# EAGLE design con68k-led (EAGLE 7.6.0)
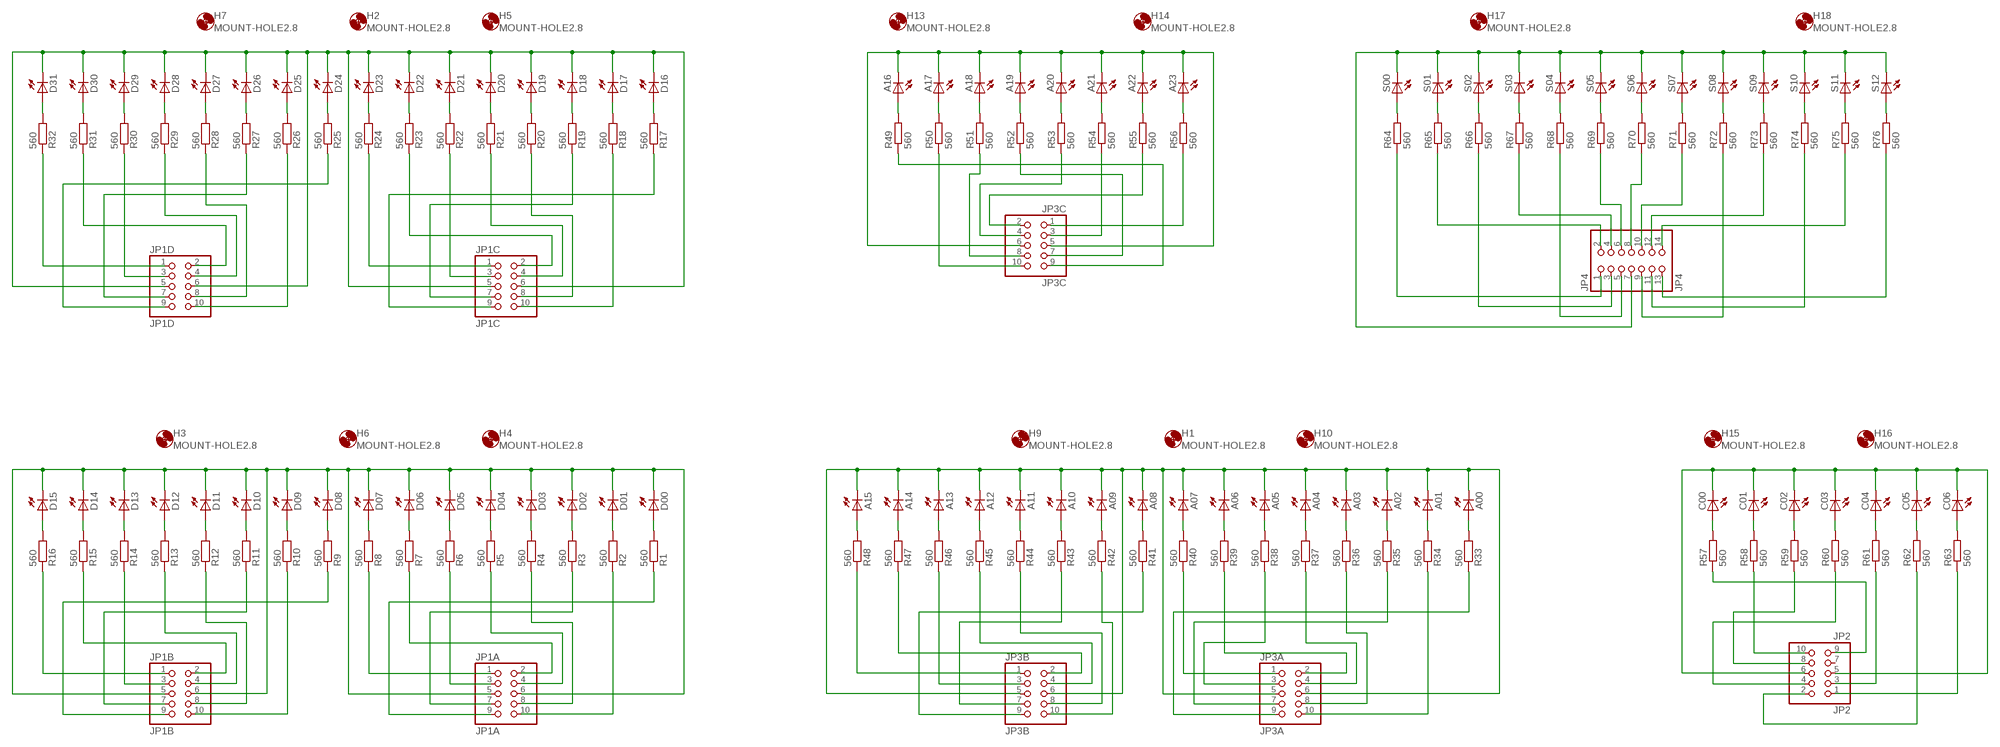
[diagram p0: schematic, sheet 1]

## Parts
A00  LED5MM  [LED5MM]
A01  LED5MM  [LED5MM]
A02  LED5MM  [LED5MM]
A03  LED5MM  [LED5MM]
A04  LED5MM  [LED5MM]
A05  LED5MM  [LED5MM]
A06  LED5MM  [LED5MM]
A07  LED5MM  [LED5MM]
A08  LED5MM  [LED5MM]
A09  LED5MM  [LED5MM]
A10  LED5MM  [LED5MM]
A11  LED5MM  [LED5MM]
A12  LED5MM  [LED5MM]
A13  LED5MM  [LED5MM]
A14  LED5MM  [LED5MM]
A15  LED5MM  [LED5MM]
A16  LED5MM  [LED5MM]
A17  LED5MM  [LED5MM]
A18  LED5MM  [LED5MM]
A19  LED5MM  [LED5MM]
A20  LED5MM  [LED5MM]
A21  LED5MM  [LED5MM]
A22  LED5MM  [LED5MM]
A23  LED5MM  [LED5MM]
C00  LED5MM  [LED5MM]
C01  LED5MM  [LED5MM]
C02  LED5MM  [LED5MM]
C03  LED5MM  [LED5MM]
C04  LED5MM  [LED5MM]
C05  LED5MM  [LED5MM]
C06  LED5MM  [LED5MM]
D00  LED5MM  [LED5MM]
D01  LED5MM  [LED5MM]
D02  LED5MM  [LED5MM]
D03  LED5MM  [LED5MM]
D04  LED5MM  [LED5MM]
D05  LED5MM  [LED5MM]
D06  LED5MM  [LED5MM]
D07  LED5MM  [LED5MM]
D08  LED5MM  [LED5MM]
D09  LED5MM  [LED5MM]
D10  LED5MM  [LED5MM]
D11  LED5MM  [LED5MM]
D12  LED5MM  [LED5MM]
D13  LED5MM  [LED5MM]
D14  LED5MM  [LED5MM]
D15  LED5MM  [LED5MM]
D16  LED5MM  [LED5MM]
D17  LED5MM  [LED5MM]
D18  LED5MM  [LED5MM]
D19  LED5MM  [LED5MM]
D20  LED5MM  [LED5MM]
D21  LED5MM  [LED5MM]
D22  LED5MM  [LED5MM]
D23  LED5MM  [LED5MM]
D24  LED5MM  [LED5MM]
D25  LED5MM  [LED5MM]
D26  LED5MM  [LED5MM]
D27  LED5MM  [LED5MM]
D28  LED5MM  [LED5MM]
D29  LED5MM  [LED5MM]
D30  LED5MM  [LED5MM]
D31  LED5MM  [LED5MM]
H1  MOUNT-HOLE2.8  [2,8]
H2  MOUNT-HOLE2.8  [2,8]
H3  MOUNT-HOLE2.8  [2,8]
H4  MOUNT-HOLE2.8  [2,8]
H5  MOUNT-HOLE2.8  [2,8]
H6  MOUNT-HOLE2.8  [2,8]
H7  MOUNT-HOLE2.8  [2,8]
H9  MOUNT-HOLE2.8  [2,8]
H10  MOUNT-HOLE2.8  [2,8]
H13  MOUNT-HOLE2.8  [2,8]
H14  MOUNT-HOLE2.8  [2,8]
H15  MOUNT-HOLE2.8  [2,8]
H16  MOUNT-HOLE2.8  [2,8]
H17  MOUNT-HOLE2.8  [2,8]
H18  MOUNT-HOLE2.8  [2,8]
JP1A  JP1A  PINHD-2X5  [2X05]
JP1B  JP1B  PINHD-2X5  [2X05]
JP1C  JP1C  PINHD-2X5  [2X05]
JP1D  JP1D  PINHD-2X5  [2X05]
JP2  JP2  PINHD-2X5  [2X05]
JP3A  JP3A  PINHD-2X5  [2X05]
JP3B  JP3B  PINHD-2X5  [2X05]
JP3C  JP3C  PINHD-2X5  [2X05]
JP4  JP4  PINHD-2X7  [2X07]
R1  560  R-EU_0204/7  [0204/7]
R2  560  R-EU_0204/7  [0204/7]
R3  560  R-EU_0204/7  [0204/7]
R4  560  R-EU_0204/7  [0204/7]
R5  560  R-EU_0204/7  [0204/7]
R6  560  R-EU_0204/7  [0204/7]
R7  560  R-EU_0204/7  [0204/7]
R8  560  R-EU_0204/7  [0204/7]
R9  560  R-EU_0204/7  [0204/7]
R10  560  R-EU_0204/7  [0204/7]
R11  560  R-EU_0204/7  [0204/7]
R12  560  R-EU_0204/7  [0204/7]
R13  560  R-EU_0204/7  [0204/7]
R14  560  R-EU_0204/7  [0204/7]
R15  560  R-EU_0204/7  [0204/7]
R16  560  R-EU_0204/7  [0204/7]
R17  560  R-EU_0204/7  [0204/7]
R18  560  R-EU_0204/7  [0204/7]
R19  560  R-EU_0204/7  [0204/7]
R20  560  R-EU_0204/7  [0204/7]
R21  560  R-EU_0204/7  [0204/7]
R22  560  R-EU_0204/7  [0204/7]
R23  560  R-EU_0204/7  [0204/7]
R24  560  R-EU_0204/7  [0204/7]
R25  560  R-EU_0204/7  [0204/7]
R26  560  R-EU_0204/7  [0204/7]
R27  560  R-EU_0204/7  [0204/7]
R28  560  R-EU_0204/7  [0204/7]
R29  560  R-EU_0204/7  [0204/7]
R30  560  R-EU_0204/7  [0204/7]
R31  560  R-EU_0204/7  [0204/7]
R32  560  R-EU_0204/7  [0204/7]
R33  560  R-EU_0204/7  [0204/7]
R34  560  R-EU_0204/7  [0204/7]
R35  560  R-EU_0204/7  [0204/7]
R36  560  R-EU_0204/7  [0204/7]
R37  560  R-EU_0204/7  [0204/7]
R38  560  R-EU_0204/7  [0204/7]
R39  560  R-EU_0204/7  [0204/7]
R40  560  R-EU_0204/7  [0204/7]
R41  560  R-EU_0204/7  [0204/7]
R42  560  R-EU_0204/7  [0204/7]
R43  560  R-EU_0204/7  [0204/7]
R44  560  R-EU_0204/7  [0204/7]
R45  560  R-EU_0204/7  [0204/7]
R46  560  R-EU_0204/7  [0204/7]
R47  560  R-EU_0204/7  [0204/7]
R48  560  R-EU_0204/7  [0204/7]
R49  560  R-EU_0204/7  [0204/7]
R50  560  R-EU_0204/7  [0204/7]
R51  560  R-EU_0204/7  [0204/7]
R52  560  R-EU_0204/7  [0204/7]
R53  560  R-EU_0204/7  [0204/7]
R54  560  R-EU_0204/7  [0204/7]
R55  560  R-EU_0204/7  [0204/7]
R56  560  R-EU_0204/7  [0204/7]
R57  560  R-EU_0204/7  [0204/7]
R58  560  R-EU_0204/7  [0204/7]
R59  560  R-EU_0204/7  [0204/7]
R60  560  R-EU_0204/7  [0204/7]
R61  560  R-EU_0204/7  [0204/7]
R62  560  R-EU_0204/7  [0204/7]
R63  560  R-EU_0204/7  [0204/7]
R64  560  R-EU_0204/7  [0204/7]
R65  560  R-EU_0204/7  [0204/7]
R66  560  R-EU_0204/7  [0204/7]
R67  560  R-EU_0204/7  [0204/7]
R68  560  R-EU_0204/7  [0204/7]
R69  560  R-EU_0204/7  [0204/7]
R70  560  R-EU_0204/7  [0204/7]
R71  560  R-EU_0204/7  [0204/7]
R72  560  R-EU_0204/7  [0204/7]
R73  560  R-EU_0204/7  [0204/7]
R74  560  R-EU_0204/7  [0204/7]
R75  560  R-EU_0204/7  [0204/7]
R76  560  R-EU_0204/7  [0204/7]
S00  LED5MM  [LED5MM]
S01  LED5MM  [LED5MM]
S02  LED5MM  [LED5MM]
S03  LED5MM  [LED5MM]
S04  LED5MM  [LED5MM]
S05  LED5MM  [LED5MM]
S06  LED5MM  [LED5MM]
S07  LED5MM  [LED5MM]
S08  LED5MM  [LED5MM]
S09  LED5MM  [LED5MM]
S10  LED5MM  [LED5MM]
S11  LED5MM  [LED5MM]
S12  LED5MM  [LED5MM]

## Nets
N$1: D00.K(C) D01.K(C) D02.K(C) D03.K(C) D04.K(C) D05.K(C) D06.K(C) D07.K(C) D08.K(C) D09.K(C) D10.K(C) D11.K(C) D12.K(C) D13.K(C) D14.K(C) D15.K(C) JP1A.5 JP1A.6 JP1B.5 JP1B.6
N$2: D15.A R16.2
N$3: D14.A R15.2
N$4: D13.A R14.2
N$5: D12.A R13.2
N$6: D11.A R12.2
N$7: D10.A R11.2
N$8: D09.A R10.2
N$9: D08.A R9.2
N$10: D07.A R8.2
N$11: D06.A R7.2
N$12: D05.A R6.2
N$13: D04.A R5.2
N$14: D03.A R4.2
N$15: D02.A R3.2
N$16: D01.A R2.2
N$17: D00.A R1.2
N$18: JP1B.1 R16.1
N$19: JP1B.2 R15.1
N$20: JP1B.3 R14.1
N$21: JP1B.4 R13.1
N$22: JP1B.8 R12.1
N$23: JP1B.7 R11.1
N$24: JP1B.10 R10.1
N$25: JP1B.9 R9.1
N$26: JP1A.1 R8.1
N$27: JP1A.2 R7.1
N$28: JP1A.3 R6.1
N$29: JP1A.4 R5.1
N$30: JP1A.8 R4.1
N$31: JP1A.7 R3.1
N$32: JP1A.10 R2.1
N$33: JP1A.9 R1.1
N$34: D16.K(C) D17.K(C) D18.K(C) D19.K(C) D20.K(C) D21.K(C) D22.K(C) D23.K(C) D24.K(C) D25.K(C) D26.K(C) D27.K(C) D28.K(C) D29.K(C) D30.K(C) D31.K(C) JP1C.5 JP1C.6 JP1D.5 JP1D.6
N$35: D31.A R32.2
N$36: D30.A R31.2
N$37: D29.A R30.2
N$38: D28.A R29.2
N$39: D27.A R28.2
N$40: D26.A R27.2
N$41: D25.A R26.2
N$42: D24.A R25.2
N$43: D23.A R24.2
N$44: D22.A R23.2
N$45: D21.A R22.2
N$46: D20.A R21.2
N$47: D19.A R20.2
N$48: D18.A R19.2
N$49: D17.A R18.2
N$50: D16.A R17.2
N$51: A15.A R48.2
N$52: JP1D.1 R32.1
N$53: JP1D.2 R31.1
N$54: JP1D.3 R30.1
N$55: JP1D.4 R29.1
N$56: JP1D.8 R28.1
N$57: JP1D.7 R27.1
N$58: JP1D.10 R26.1
N$59: JP3B.1 R48.1
N$60: JP1D.9 R25.1
N$61: JP1C.1 R24.1
N$62: JP1C.2 R23.1
N$63: JP1C.3 R22.1
N$64: JP1C.4 R21.1
N$65: A14.A R47.2
N$66: JP1C.8 R20.1
N$67: A00.K(C) A01.K(C) A02.K(C) A03.K(C) A04.K(C) A05.K(C) A06.K(C) A07.K(C) A08.K(C) A09.K(C) A10.K(C) A11.K(C) A12.K(C) A13.K(C) A14.K(C) A15.K(C) JP3A.5 JP3A.6 JP3B.5 JP3B.6
N$68: A13.A R46.2
N$69: A12.A R45.2
N$70: A11.A R44.2
N$71: A10.A R43.2
N$72: A09.A R42.2
N$73: A08.A R41.2
N$74: A07.A R40.2
N$75: A06.A R39.2
N$76: A05.A R38.2
N$77: A04.A R37.2
N$78: A03.A R36.2
N$79: A02.A R35.2
N$80: A01.A R34.2
N$81: A00.A R33.2
N$82: A16.A R49.2
N$83: A17.A R50.2
N$84: JP3B.2 R47.1
N$85: JP3B.3 R46.1
N$86: JP3B.4 R45.1
N$87: JP3A.1 R40.1
N$88: JP3B.8 R44.1
N$89: JP3B.7 R43.1
N$90: JP4.1 R64.1
N$91: JP3B.10 R42.1
N$92: JP4.2 R65.1
N$93: JP3B.9 R41.1
N$94: JP3A.2 R39.1
N$95: JP3A.3 R38.1
N$96: JP3A.4 R37.1
N$97: JP3A.8 R36.1
N$98: JP3A.7 R35.1
N$99: JP3A.10 R34.1
N$100: A16.K(C) A17.K(C) A18.K(C) A19.K(C) A20.K(C) A21.K(C) A22.K(C) A23.K(C) JP3C.5 JP3C.6
N$101: A18.A R51.2
N$102: A19.A R52.2
N$103: A20.A R53.2
N$104: A21.A R54.2
N$105: A22.A R55.2
N$106: A23.A R56.2
N$107: R64.2 S00.A
N$108: R65.2 S01.A
N$109: JP2.1 R63.1
N$110: JP3C.1 R56.1
N$111: JP3C.2 R55.1
N$112: JP3C.3 R54.1
N$113: JP3C.4 R53.1
N$114: JP3C.7 R52.1
N$115: JP3C.8 R51.1
N$116: JP3C.10 R50.1
N$117: JP3C.9 R49.1
N$118: C00.K(C) C01.K(C) C02.K(C) C03.K(C) C04.K(C) C05.K(C) C06.K(C) JP2.5 JP2.6
N$119: C00.A R57.2
N$120: C01.A R58.2
N$121: C02.A R59.2
N$122: C03.A R60.2
N$123: C04.A R61.2
N$124: C05.A R62.2
N$125: C06.A R63.2
N$126: JP2.2 R62.1
N$127: JP2.3 R61.1
N$128: JP2.4 R60.1
N$129: JP2.9 R57.1
N$130: JP2.10 R58.1
N$131: JP2.8 R59.1
N$132: JP4.7 S00.K(C) S01.K(C) S02.K(C) S03.K(C) S04.K(C) S05.K(C) S06.K(C) S07.K(C) S08.K(C) S09.K(C) S10.K(C) S11.K(C) S12.K(C)
N$133: R66.2 S02.A
N$134: R67.2 S03.A
N$135: R68.2 S04.A
N$136: R69.2 S05.A
N$137: R70.2 S06.A
N$138: R71.2 S07.A
N$139: R72.2 S08.A
N$140: R73.2 S09.A
N$141: R74.2 S10.A
N$142: R75.2 S11.A
N$143: R76.2 S12.A
N$146: JP4.3 R66.1
N$147: JP4.4 R67.1
N$148: JP4.5 R68.1
N$149: JP4.6 R69.1
N$150: JP4.13 R76.1
N$151: JP4.14 R75.1
N$152: JP4.11 R74.1
N$153: JP4.12 R73.1
N$154: JP4.9 R72.1
N$155: JP4.10 R71.1
N$156: JP4.8 R70.1
N$157: JP3A.9 R33.1
N$158: JP1C.7 R19.1
N$159: JP1C.10 R18.1
N$160: JP1C.9 R17.1
Unconnected: JP2.7

## Library data of the parts
A00 A01-A09 A10-A23 C00 C01-C06 D00 D01-D09 D10-D31 S00 S01-S09 S10-S12 = henk:LED: LEDs Standard schematic elements and footprints for 5mm, 3mm, 1206, and 0603 sized LEDs. 5mm - Spark Fun Electronics SKU : COM-00529 (and others)
H1-H7 H9 H10 H13-H18 = holes:MOUNT-HOLE: MOUNTING HOLE with drill center marker
JP1A JP1B JP1C JP1D JP2 JP3A JP3B JP3C = pinhead:PINHD-2X5: PIN HEADER
JP4 = pinhead:PINHD-2X7: PIN HEADER
R1-R76 = rcl:R-EU_: RESISTOR, European symbol

## Net classes
0 default: width 0.254 mm, drill 0.254 mm, clearance 0.254 mm

## Board
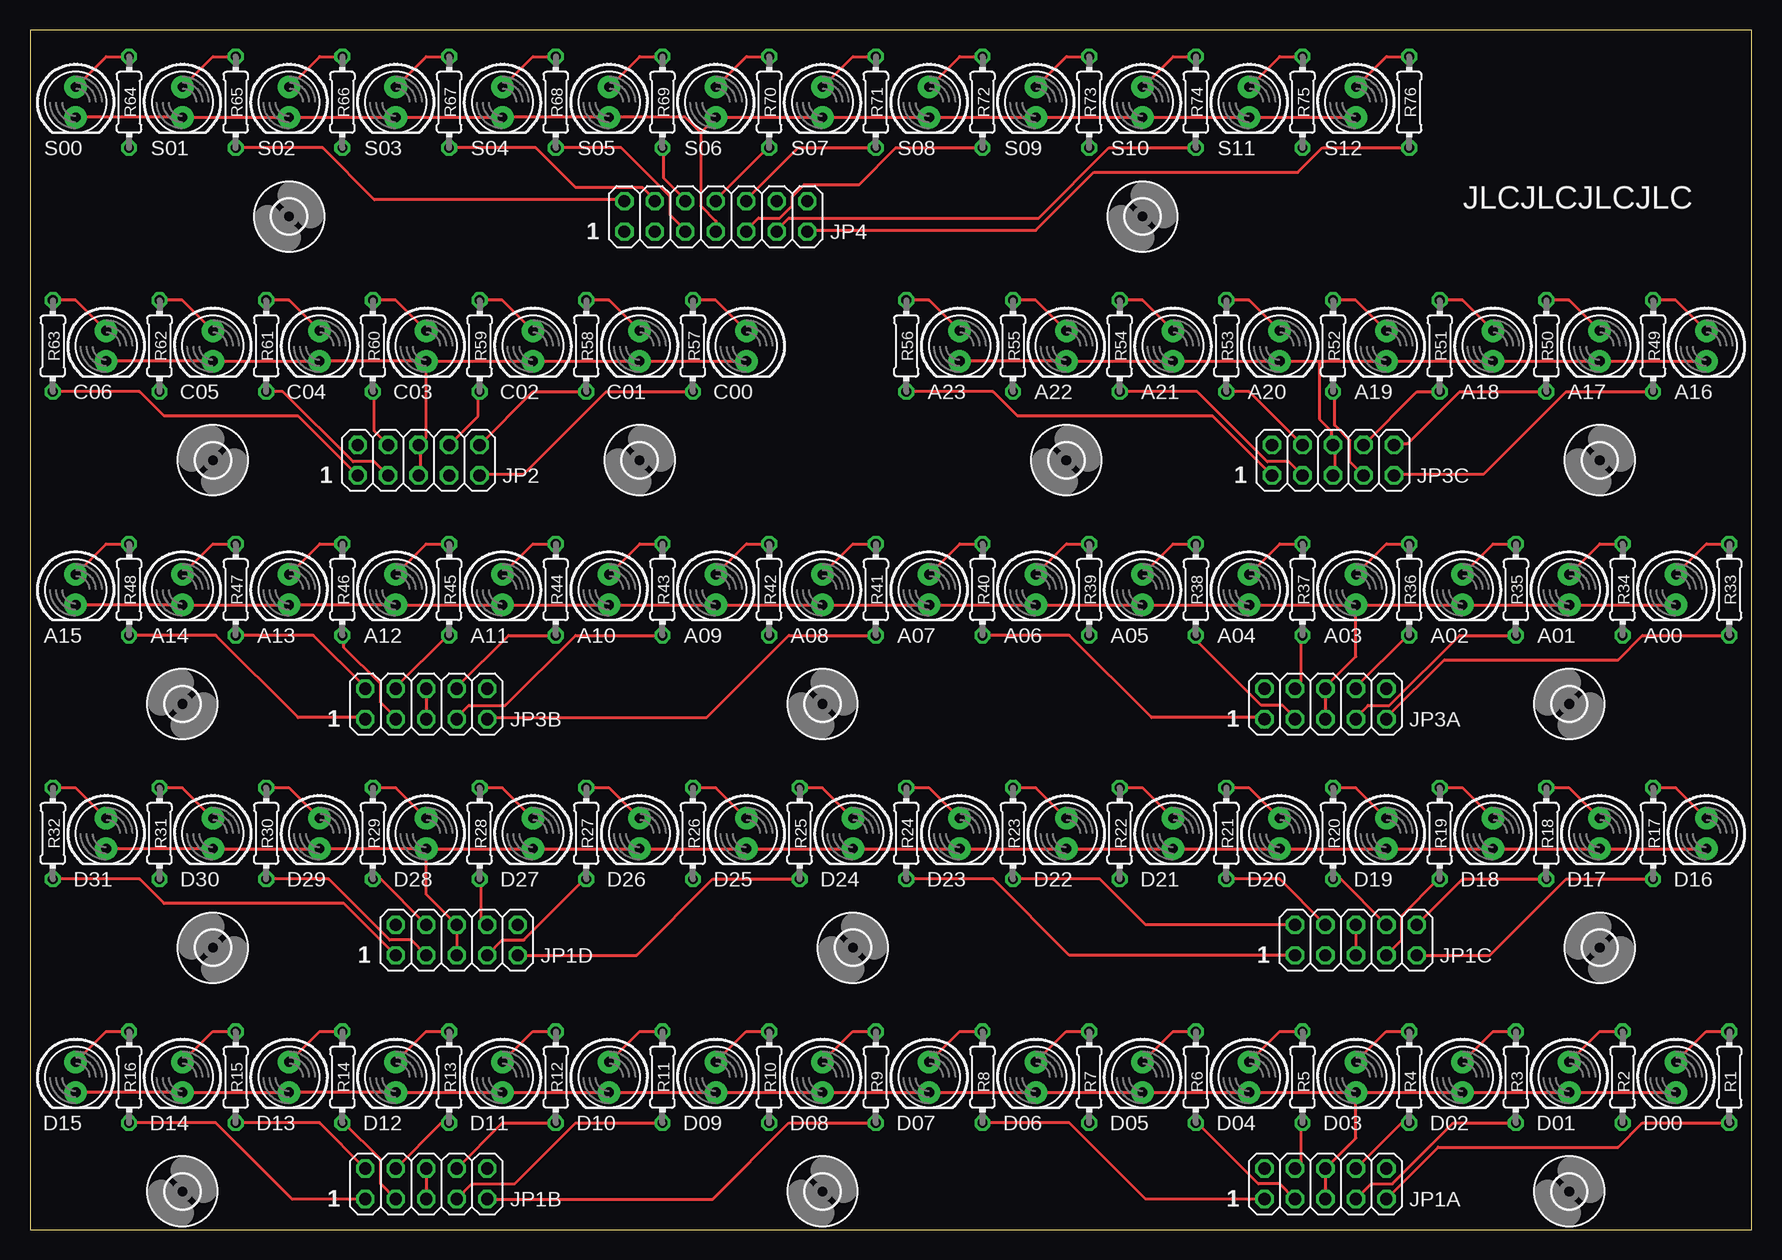
[diagram p1: board, top side]
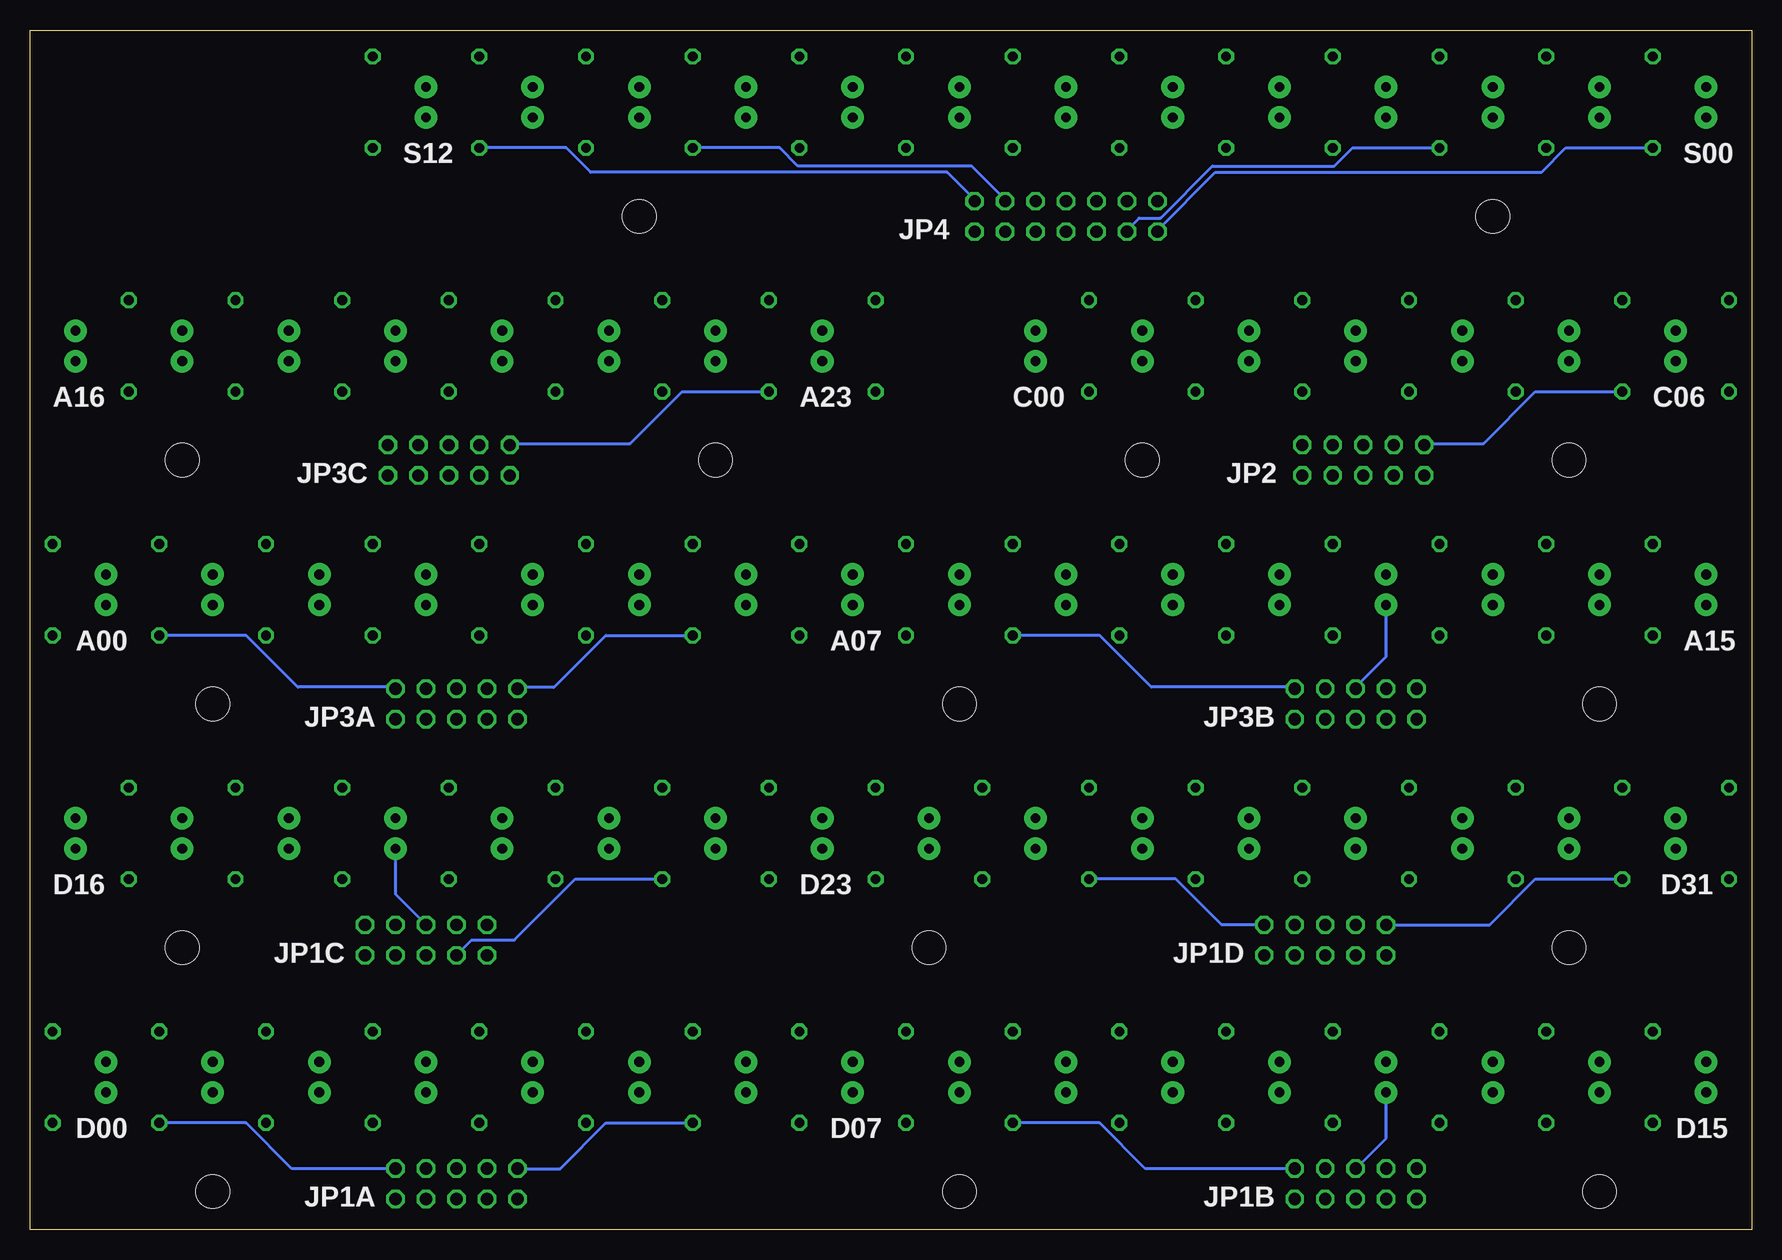
[diagram p2: board, bottom side, seen from below]

Size 143.49 x 100 mm. Coordinates in mm from the lower left corner, seen from the top.
Outline: 0,0 143.49,0 143.49,100 0,100 0,0
Copper layers (1*16): Top 0.035mm / dielectric 1.5mm / Bottom 0.035mm
Design rules "ITEADstudio_DRC": minimum track width 6mil, minimum drill 12mil, track to track 6mil, track to pad 6mil, pad to pad 6mil, via to via 6mil, smd to smd 0mil, copper to edge 10mil, drill to drill 10mil, minimum pad ring 10mil, minimum via ring 6mil, stop-mask expansion 2mil, vias tented up to drill 100mil, thermal gap 10mil

### Footprints (pad centres in the part's own frame; a part is rotated, then mirrored left to right if it is on the bottom)
LED5MM = drill 0.813 pad 1.88: A -1.27,0; K 1.27,0
2,8 = hole 2.8: 0,0
2X05 = drill 1.016 octagon: 1 -5.08,-1.27; 2 -5.08,1.27; 3 -2.54,-1.27; 4 -2.54,1.27; 5 0,-1.27; 6 0,1.27; 7 2.54,-1.27; 8 2.54,1.27; 9 5.08,-1.27; 10 5.08,1.27
2X07 = drill 1.016 octagon: 1 -7.62,-1.27; 2 -7.62,1.27; 3 -5.08,-1.27; 4 -5.08,1.27; 5 -2.54,-1.27; 6 -2.54,1.27; 7 0,-1.27; 8 0,1.27; 9 2.54,-1.27; 10 2.54,1.27; 11 5.08,-1.27; 12 5.08,1.27; 13 7.62,-1.27; 14 7.62,1.27
0204/7 = drill 0.813 octagon: 1 -3.81,0; 2 3.81,0

### Placement (x,y rotation side)
A00  137.16,53.34 270 top
A01  128.27,53.34 270 top
A02  119.38,53.34 270 top
A03  110.49,53.34 270 top
A04  101.6,53.34 270 top
A05  92.71,53.34 270 top
A06  83.82,53.34 270 top
A07  74.93,53.34 270 top
A08  66.04,53.34 270 top
A09  57.15,53.34 270 top
A10  48.26,53.34 270 top
A11  39.37,53.34 270 top
A12  30.48,53.34 270 top
A13  21.59,53.34 270 top
A14  12.7,53.34 270 top
A15  3.81,53.34 270 top
A16  139.7,73.66 270 top
A17  130.81,73.66 270 top
A18  121.92,73.66 270 top
A19  113.03,73.66 270 top
A20  104.14,73.66 270 top
A21  95.25,73.66 270 top
A22  86.36,73.66 270 top
A23  77.47,73.66 270 top
C00  59.69,73.66 270 top
C01  50.8,73.66 270 top
C02  41.91,73.66 270 top
C03  33.02,73.66 270 top
C04  24.13,73.66 270 top
C05  15.24,73.66 270 top
C06  6.35,73.66 270 top
D00  137.16,12.7 270 top
D01  128.27,12.7 270 top
D02  119.38,12.7 270 top
D03  110.49,12.7 270 top
D04  101.6,12.7 270 top
D05  92.71,12.7 270 top
D06  83.82,12.7 270 top
D07  74.93,12.7 270 top
D08  66.04,12.7 270 top
D09  57.15,12.7 270 top
D10  48.26,12.7 270 top
D11  39.37,12.7 270 top
D12  30.48,12.7 270 top
D13  21.59,12.7 270 top
D14  12.7,12.7 270 top
D15  3.81,12.7 270 top
D16  139.7,33.02 270 top
D17  130.81,33.02 270 top
D18  121.92,33.02 270 top
D19  113.03,33.02 270 top
D20  104.14,33.02 270 top
D21  95.25,33.02 270 top
D22  86.36,33.02 270 top
D23  77.47,33.02 270 top
D24  68.58,33.02 270 top
D25  59.69,33.02 270 top
D26  50.8,33.02 270 top
D27  41.91,33.02 270 top
D28  33.02,33.02 270 top
D29  24.13,33.02 270 top
D30  15.24,33.02 270 top
D31  6.35,33.02 270 top
H1  66.04,43.81 0 top
H2  68.58,23.5 0 top
H3  12.7,3.17 0 top
H4  128.27,3.17 0 top
H5  15.24,23.5 90 top
H6  66.04,3.17 0 top
H7  130.81,23.5 90 top
H9  12.7,43.81 90 top
H10  128.27,43.81 90 top
H13  130.81,64.14 0 top
H14  86.36,64.14 0 top
H15  15.24,64.14 90 top
H16  50.8,64.14 0 top
H17  21.59,84.45 0 top
H18  92.71,84.45 0 top
JP1A  107.95,3.81 0 top
JP1B  33.02,3.81 0 top
JP1C  110.49,24.13 0 top
JP1D  35.56,24.13 0 top
JP2  32.38,64.14 0 top
JP3A  107.95,43.81 0 top
JP3B  33.02,43.81 0 top
JP3C  108.58,64.14 0 top
JP4  57.15,84.45 0 top
R1  141.6,12.7 90 top
R2  132.72,12.7 90 top
R3  123.83,12.7 90 top
R4  114.94,12.7 90 top
R5  106.05,12.7 90 top
R6  97.16,12.7 90 top
R7  88.27,12.7 90 top
R8  79.38,12.7 90 top
R9  70.48,12.7 90 top
R10  61.59,12.7 90 top
R11  52.7,12.7 90 top
R12  43.81,12.7 90 top
R13  34.92,12.7 90 top
R14  26.04,12.7 90 top
R15  17.14,12.7 90 top
R16  8.26,12.7 90 top
R17  135.25,33.02 90 top
R18  126.36,33.02 90 top
R19  117.47,33.02 90 top
R20  108.58,33.02 90 top
R21  99.69,33.02 90 top
R22  90.81,33.02 90 top
R23  81.92,33.02 90 top
R24  73.03,33.02 90 top
R25  64.14,33.02 90 top
R26  55.24,33.02 90 top
R27  46.35,33.02 90 top
R28  37.47,33.02 90 top
R29  28.57,33.02 90 top
R30  19.68,33.02 90 top
R31  10.79,33.02 90 top
R32  1.91,33.02 90 top
R33  141.6,53.34 90 top
R34  132.72,53.34 90 top
R35  123.83,53.34 90 top
R36  114.94,53.34 90 top
R37  106.05,53.34 90 top
R38  97.16,53.34 90 top
R39  88.27,53.34 90 top
R40  79.38,53.34 90 top
R41  70.48,53.34 90 top
R42  61.59,53.34 90 top
R43  52.7,53.34 90 top
R44  43.81,53.34 90 top
R45  34.92,53.34 90 top
R46  26.04,53.34 90 top
R47  17.14,53.34 90 top
R48  8.26,53.34 90 top
R49  135.25,73.66 90 top
R50  126.36,73.66 90 top
R51  117.47,73.66 90 top
R52  108.58,73.66 90 top
R53  99.69,73.66 90 top
R54  90.81,73.66 90 top
R55  81.92,73.66 90 top
R56  73.03,73.66 90 top
R57  55.24,73.66 90 top
R58  46.35,73.66 90 top
R59  37.47,73.66 90 top
R60  28.57,73.66 90 top
R61  19.68,73.66 90 top
R62  10.79,73.66 90 top
R63  1.91,73.66 90 top
R64  8.26,93.98 90 top
R65  17.14,93.98 90 top
R66  26.04,93.98 90 top
R67  34.92,93.98 90 top
R68  43.81,93.98 90 top
R69  52.7,93.98 90 top
R70  61.59,93.98 90 top
R71  70.48,93.98 90 top
R72  79.38,93.98 90 top
R73  88.27,93.98 90 top
R74  97.16,93.98 90 top
R75  106.05,93.98 90 top
R76  114.94,93.98 90 top
S00  3.81,93.98 270 top
S01  12.7,93.98 270 top
S02  21.59,93.98 270 top
S03  30.48,93.98 270 top
S04  39.37,93.98 270 top
S05  48.26,93.98 270 top
S06  57.15,93.98 270 top
S07  66.04,93.98 270 top
S08  74.93,93.98 270 top
S09  83.82,93.98 270 top
S10  92.71,93.98 270 top
S11  101.6,93.98 270 top
S12  110.49,93.98 270 top

### Tracks (layer width: path | path; a pad name or v marks a point on that pad's centre or on a via)
N$1
  Top 0.254: JP1A.5 JP1A.6 110.49,7.62 D03.K | D03.K D02.K D01.K D00.K | D15.K D14.K D13.K D12.K D11.K D10.K D09.K D08.K D07.K D06.K D05.K D04.K D03.K | JP1B.6 JP1B.5
  Bottom 0.254: D12.K 30.48,7.62 JP1B.6
N$2
  Top 0.254: R16.2 6.35,16.51 D15.A
N$3
  Top 0.254: R15.2 15.24,16.51 D14.A
N$4
  Top 0.254: R14.2 24.13,16.51 D13.A
N$5
  Top 0.254: R13.2 33.02,16.51 D12.A
N$6
  Top 0.254: R12.2 41.91,16.51 D11.A
N$7
  Top 0.254: R11.2 50.8,16.51 D10.A
N$8
  Top 0.254: R10.2 59.69,16.51 D09.A
N$9
  Top 0.254: R9.2 68.58,16.51 D08.A
N$10
  Top 0.254: R8.2 77.47,16.51 D07.A
N$11
  Top 0.254: R7.2 86.36,16.51 D06.A
N$12
  Top 0.254: R6.2 95.25,16.51 D05.A
N$13
  Top 0.254: R5.2 104.14,16.51 D04.A
N$14
  Top 0.254: R4.2 113.03,16.51 D03.A
N$15
  Top 0.254: R3.2 121.92,16.51 D02.A
N$16
  Top 0.254: R2.2 130.81,16.51 D01.A
N$17
  Top 0.254: R1.2 139.7,16.51 D00.A
N$18
  Top 0.254: R16.1 15.49,8.89 21.84,2.54 JP1B.1
N$19
  Top 0.254: R15.1 24.13,8.89 JP1B.2
N$20
  Top 0.254: JP1B.3 29.21,3.81 29.21,5.84 26.16,8.89 R14.1
N$21
  Top 0.254: R13.1 34.29,8.89 JP1B.4
N$22
  Top 0.254: R12.1 39.37,8.89 JP1B.8
N$23
  Top 0.254: R11.1 45.47,8.89 40.39,3.81 36.83,3.81 JP1B.7
N$24
  Bottom 0.254: R10.1 54.36,8.89 50.55,5.08 JP1B.10
N$25
  Top 0.254: R9.1 63.25,8.89 56.9,2.54 JP1B.9
N$26
  Top 0.254: R8.1 86.61,8.89 92.96,2.54 JP1A.1
N$27
  Bottom 0.254: R7.1 95.5,8.89 99.31,5.08 JP1A.2
N$28
  Top 0.254: JP1A.3 104.14,3.81 102.36,3.81 97.28,8.89 R6.1
N$29
  Top 0.254: JP1A.4 105.92,5.59 105.92,8.89 R5.1
N$30
  Top 0.254: R4.1 114.3,8.89 JP1A.8
N$31
  Top 0.254: R3.1 118.62,8.89 113.54,3.81 111.76,3.81 JP1A.7
N$32
  Bottom 0.254: R2.1 125.48,8.89 121.67,5.08 JP1A.10
N$33
  Top 0.254: R1.1 134.37,8.89 132.33,6.86 117.35,6.86 JP1A.9
N$34
  Top 0.254: JP1C.6 JP1C.5 | D16.K D17.K D18.K D19.K D20.K D21.K D22.K D23.K D24.K D25.K D26.K D27.K D28.K | D31.K D30.K D29.K D28.K | JP1D.5 JP1D.6 33.02,27.94 D28.K
  Bottom 0.254: D19.K 113.03,27.94 JP1C.6
N$35
  Top 0.254: R32.2 3.81,36.83 D31.A
N$36
  Top 0.254: R31.2 12.7,36.83 D30.A
N$37
  Top 0.254: R30.2 21.59,36.83 D29.A
N$38
  Top 0.254: R29.2 30.48,36.83 D28.A
N$39
  Top 0.254: R28.2 39.37,36.83 D27.A
N$40
  Top 0.254: R27.2 48.26,36.83 D26.A
N$41
  Top 0.254: R26.2 57.15,36.83 D25.A
N$42
  Top 0.254: R25.2 66.04,36.83 D24.A
N$43
  Top 0.254: R24.2 74.93,36.83 D23.A
N$44
  Top 0.254: R23.2 83.82,36.83 D22.A
N$45
  Top 0.254: R22.2 92.71,36.83 D21.A
N$46
  Top 0.254: R21.2 101.6,36.83 D20.A
N$47
  Top 0.254: R20.2 110.49,36.83 D19.A
N$48
  Top 0.254: R19.2 119.38,36.83 D18.A
N$49
  Top 0.254: R18.2 128.27,36.83 D17.A
N$50
  Top 0.254: R17.2 137.16,36.83 D16.A
N$51
  Top 0.254: R48.2 6.35,57.15 A15.A
N$52
  Top 0.254: R32.1 9.14,29.21 11.18,27.18 26.16,27.18 JP1D.1
N$53
  Bottom 0.254: R31.1 18.03,29.21 21.84,25.4 JP1D.2
N$54
  Top 0.254: R30.1 24.89,29.21 29.97,24.13 31.75,24.13 JP1D.3
N$55
  Top 0.254: R29.1 29.21,29.21 JP1D.4
N$56
  Top 0.254: JP1D.8 37.59,25.91 37.59,29.21 R28.1
N$57
  Top 0.254: JP1D.7 39.37,24.13 41.15,24.13 46.23,29.21 R27.1
N$58
  Bottom 0.254: R26.1 48.01,29.21 44.2,25.4 JP1D.10
N$59
  Top 0.254: R48.1 15.49,49.53 22.35,42.67 27.94,42.67 JP3B.1
N$60
  Top 0.254: R25.1 56.9,29.21 50.55,22.86 JP1D.9
N$61
  Top 0.254: R24.1 80.26,29.21 86.61,22.86 JP1C.1
N$62
  Top 0.254: R23.1 89.15,29.21 92.96,25.4 JP1C.2
N$63
  Bottom 0.254: R22.1 98.04,29.21 103.12,24.13 106.68,24.13 JP1C.3
N$64
  Top 0.254: R21.1 104.14,29.21 JP1C.4
N$65
  Top 0.254: R47.2 15.24,57.15 A14.A
N$66
  Top 0.254: R20.1 109.22,29.21 JP1C.8
N$67
  Top 0.254: JP3A.5 JP3A.6 107.95,45.21 110.49,47.75 A03.K | A03.K A02.K A01.K A00.K | A15.K A14.K A13.K A12.K A11.K A10.K A09.K A08.K A07.K A06.K A05.K A04.K A03.K | JP3B.6 JP3B.5
  Bottom 0.254: A12.K 30.48,47.75 33.02,45.21 JP3B.6
N$68
  Top 0.254: R46.2 24.13,57.15 A13.A
N$69
  Top 0.254: R45.2 33.02,57.15 A12.A
N$70
  Top 0.254: R44.2 41.91,57.15 A11.A
N$71
  Top 0.254: R43.2 50.8,57.15 A10.A
N$72
  Top 0.254: R42.2 59.69,57.15 A09.A
N$73
  Top 0.254: R41.2 68.58,57.15 A08.A
N$74
  Top 0.254: R40.2 77.47,57.15 A07.A
N$75
  Top 0.254: R39.2 86.36,57.15 A06.A
N$76
  Top 0.254: R38.2 95.25,57.15 A05.A
N$77
  Top 0.254: R37.2 104.14,57.15 A04.A
N$78
  Top 0.254: R36.2 113.03,57.15 A03.A
N$79
  Top 0.254: R35.2 121.92,57.15 A02.A
N$80
  Top 0.254: R34.2 130.81,57.15 A01.A
N$81
  Top 0.254: R33.2 139.7,57.15 A00.A
N$82
  Top 0.254: R49.2 137.16,77.47 A16.A
N$83
  Top 0.254: R50.2 128.27,77.47 A17.A
N$84
  Top 0.254: R47.1 23.62,49.53 27.94,45.21 JP3B.2
N$85
  Top 0.254: R46.1 26.16,49.53 26.16,48.51 29.21,45.47 29.21,43.94 30.48,42.67 JP3B.3
N$86
  Top 0.254: R45.1 34.8,49.53 30.48,45.21 JP3B.4
N$87
  Top 0.254: R40.1 86.61,49.53 93.47,42.67 102.87,42.67 JP3A.1
N$88
  Top 0.254: R44.1 39.88,49.53 35.56,45.21 JP3B.8
N$89
  Top 0.254: R43.1 45.47,49.53 39.62,43.69 36.58,43.69 35.56,42.67 JP3B.7
N$90
  Bottom 0.254: R64.1 15.49,90.17 17.53,88.14 44.7,88.14 49.53,83.31 JP4.1
N$91
  Bottom 0.254: R42.1 54.36,49.53 50.04,45.21 38.1,45.21 JP3B.10
N$92
  Top 0.254: R65.1 24.38,90.17 28.7,85.85 49.53,85.85 JP4.2
N$93
  Top 0.254: R41.1 63.25,49.53 56.39,42.67 38.1,42.67 JP3B.9
N$94
  Bottom 0.254: R39.1 95.5,49.53 99.82,45.21 102.87,45.21 JP3A.2
N$95
  Top 0.254: R38.1 97.28,49.53 97.28,49.02 102.62,43.69 104.39,43.69 105.41,42.67 JP3A.3
N$96
  Top 0.254: R37.1 105.92,49.53 105.92,45.72 105.41,45.21 JP3A.4
N$97
  Top 0.254: R36.1 114.81,49.53 110.49,45.21 JP3A.8
N$98
  Top 0.254: R35.1 119.13,49.53 113.28,43.69 111.51,43.69 110.49,42.67 JP3A.7
N$99
  Bottom 0.254: R34.1 125.48,49.53 121.16,45.21 113.03,45.21 JP3A.10
N$100
  Top 0.254: JP3C.5 108.71,62.99 108.71,65.28 JP3C.6 108.46,65.53 108.46,66.55 107.44,67.56 107.44,72.39 | A23.K A22.K A21.K A20.K 107.44,72.39 | 107.44,72.39 A19.K A18.K A17.K A16.K
N$101
  Top 0.254: R51.2 119.38,77.47 A18.A
N$102
  Top 0.254: R52.2 110.49,77.47 A19.A
N$103
  Top 0.254: R53.2 101.6,77.47 A20.A
N$104
  Top 0.254: R54.2 92.71,77.47 A21.A
N$105
  Top 0.254: R55.2 83.82,77.47 A22.A
N$106
  Top 0.254: R56.2 74.93,77.47 A23.A
N$107
  Top 0.254: R64.2 6.35,97.79 S00.A
N$108
  Top 0.254: R65.2 15.24,97.79 S01.A
N$109
  Top 0.254: R63.1 9.14,69.85 11.18,67.82 22.35,67.82 JP2.1
N$110
  Top 0.254: R56.1 80.26,69.85 82.3,67.82 98.55,67.82 JP3C.1
N$111
  Bottom 0.254: R55.1 89.15,69.85 93.47,65.53 103.38,65.53 JP3C.2
N$112
  Top 0.254: R54.1 97.28,69.85 103.12,64.01 104.9,64.01 JP3C.3
N$113
  Top 0.254: R53.1 101.6,69.85 JP3C.4
N$114
  Top 0.254: JP3C.7 109.98,64.01 109.98,65.79 108.71,67.06 108.71,69.85 R52.1
N$115
  Top 0.254: R51.1 115.57,69.85 JP3C.8
N$116
  Top 0.254: R50.1 119.13,69.85 114.81,65.53 113.79,65.53 JP3C.10
N$117
  Top 0.254: R49.1 128.02,69.85 121.16,62.99 113.79,62.99 JP3C.9
N$118
  Top 0.254: C06.K C05.K C04.K C03.K | JP2.5 32.51,62.99 32.51,65.28 JP2.6 33.02,66.04 C03.K | C03.K C02.K C01.K C00.K
N$119
  Top 0.254: R57.2 57.15,77.47 C00.A
N$120
  Top 0.254: R58.2 48.26,77.47 C01.A
N$121
  Top 0.254: R59.2 39.37,77.47 C02.A
N$122
  Top 0.254: R60.2 30.48,77.47 C03.A
N$123
  Top 0.254: R61.2 21.59,77.47 C04.A
N$124
  Top 0.254: R62.2 12.7,77.47 C05.A
N$125
  Top 0.254: R63.2 3.81,77.47 C06.A
N$126
  Bottom 0.254: R62.1 18.03,69.85 22.35,65.53 27.18,65.53 JP2.2
N$127
  Top 0.254: R61.1 21.08,69.85 26.92,64.01 28.7,64.01 JP2.3
N$128
  Top 0.254: JP2.4 28.7,66.55 28.7,69.85 R60.1
N$129
  Top 0.254: R57.1 48.01,69.85 41.15,62.99 37.59,62.99 JP2.9
N$130
  Top 0.254: R58.1 41.91,69.85 JP2.10
N$131
  Top 0.254: JP2.8 37.34,67.82 37.34,69.85 R59.1
N$132
  Top 0.254: S00.K S01.K S02.K S03.K S04.K S05.K 54.61,92.71 55.88,91.44 | JP4.7 57.15,84.07 55.88,85.34 55.88,91.44 | 55.88,91.44 S06.K S07.K S08.K S09.K S10.K S11.K S12.K
N$133
  Top 0.254: R66.2 24.13,97.79 S02.A
N$134
  Top 0.254: R67.2 33.02,97.79 S03.A
N$135
  Top 0.254: R68.2 41.91,97.79 S04.A
N$136
  Top 0.254: R69.2 50.8,97.79 S05.A
N$137
  Top 0.254: R70.2 59.69,97.79 S06.A
N$138
  Top 0.254: R71.2 68.58,97.79 S07.A
N$139
  Top 0.254: R72.2 77.47,97.79 S08.A
N$140
  Top 0.254: R73.2 86.36,97.79 S09.A
N$141
  Top 0.254: R74.2 95.25,97.79 S10.A
N$142
  Top 0.254: R75.2 104.14,97.79 S11.A
N$143
  Top 0.254: R76.2 113.03,97.79 S12.A
N$146
  Bottom 0.254: R66.1 33.27,90.17 34.8,88.65 44.96,88.65 49.28,84.33 51.05,84.33 52.07,83.31 JP4.3
N$147
  Top 0.254: R67.1 42.16,90.17 45.47,86.87 51.05,86.87 52.07,85.85 JP4.4
N$148
  Top 0.254: R68.1 49.28,90.17 53.34,86.11 53.34,84.58 54.61,83.31 JP4.5
N$149
  Top 0.254: R69.1 52.83,90.17 52.83,87.63 54.61,85.85 JP4.6
N$150
  Top 0.254: R76.1 107.7,90.17 105.66,88.14 88.65,88.14 83.82,83.31 64.77,83.31 JP4.13
N$151
  Bottom 0.254: R75.1 98.81,90.17 96.77,88.14 67.06,88.14 64.77,85.85 JP4.14
N$152
  Top 0.254: R74.1 89.92,90.17 84.07,84.33 63.25,84.33 62.23,83.31 JP4.11
N$153
  Bottom 0.254: R73.1 81.03,90.17 79.5,88.65 65.02,88.65 62.23,85.85 JP4.12
N$154
  Top 0.254: R72.1 72.14,90.17 69.09,87.12 64.52,87.12 63.5,86.11 63.5,85.34 62.48,84.33 60.71,84.33 59.69,83.31 JP4.9
N$155
  Top 0.254: R71.1 64.01,90.17 59.69,85.85 JP4.10
N$156
  Top 0.254: R70.1 61.47,90.17 57.15,85.85 JP4.8
N$157
  Top 0.254: R33.1 134.37,49.53 132.33,47.5 117.86,47.5 113.03,42.67 JP3A.9
N$158
  Top 0.254: JP1C.7 114.3,24.13 114.3,26.16 117.35,29.21 R19.1
N$159
  Top 0.254: R18.1 119.38,29.21 JP1C.10
N$160
  Top 0.254: R17.1 128.02,29.21 121.67,22.86 JP1C.9

### Text on the board
tNames: JLCJLCJLCJLC | 1 | 1 | 1 | 1 | 1 | 1 | 1 | 1 | 1
bNames: S00 | S12 | JP4 | C06 | C00 | A23 | A16 | JP2 | JP3C | A15 | A07 | A00 | JP3B | JP3A | D31 | D23 | D16 | JP1D | JP1C | D15 | D07 | D00 | JP1B | JP1A